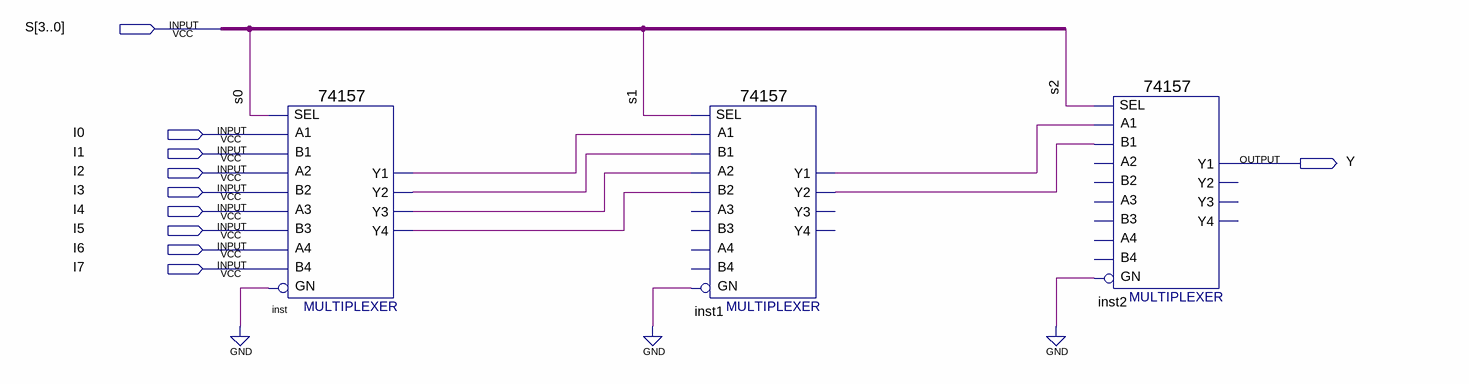
[diagram p0: schematic sheet]
// Quartus schematic mux8_1.bdf as structural Verilog: 3 symbols, 10 pins
module mux8_1 (
  input  [3:0] S,
  input  I0,
  input  I1,
  input  I2,
  input  I3,
  input  I4,
  input  I5,
  input  I6,
  input  I7,
  output Y
);

  wire inst1_y1, inst1_y2, inst_y1, inst_y2, inst_y3, inst_y4;

  \74157  inst (
    .A1(I0), .B1(I1), .SEL(S[0]), .B2(I3), .A3(I4), .B3(I5), .A2(I2), .B4(I7), .GN(1'b0), .A4(I6),
    .Y2(inst_y2), .Y1(inst_y1), .Y4(inst_y4), .Y3(inst_y3));
  \74157  inst1 (
    .A1(inst_y1), .B1(inst_y2), .SEL(S[1]), .B2(inst_y4), .A2(inst_y3), .GN(1'b0), .Y2(inst1_y2),
    .Y1(inst1_y1));  // open: A3, B3, B4, A4, Y4, Y3
  \74157  inst2 (
    .A1(inst1_y1), .B1(inst1_y2), .SEL(S[2]), .GN(1'b0), .Y1(Y));  // open: B2, A3, B3, A2, B4, A4, Y2, Y4, Y3
endmodule
